# Altium project Ixora.PrjPCB (part 3 of 3)
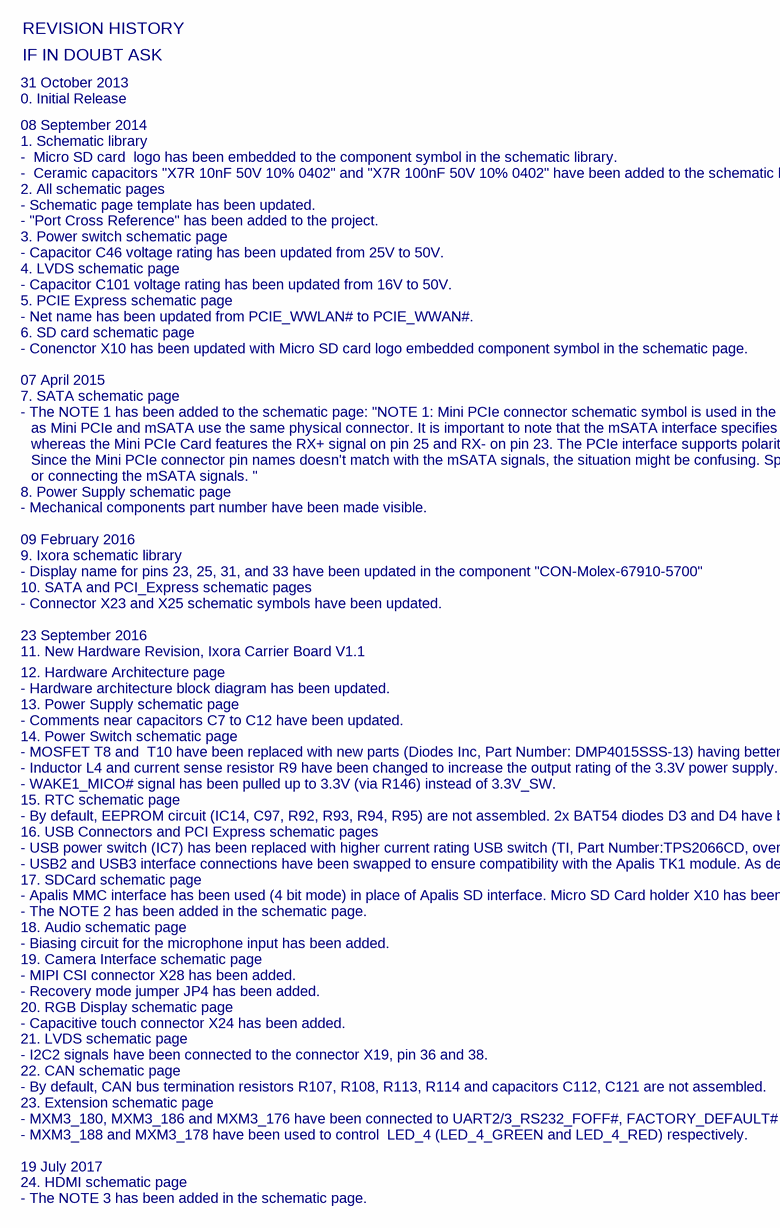
[diagram p16: Revision_History.SchDoc]

## Nets that join several sheets
3.3V: Camera_Interface (R129.1), Power_Supply (16 pins), Power_Switch (20 pins), Extension (R89.1)
3.3V_SW: Audio (IC8.3), Camera_Interface (7 pins), Ethernet (X11.14 X11.16), PCI_Express (5 pins), Power_Supply (C1.2 R1.1 X4.1), Power_Switch (6 pins), RGB_Display (6 pins), RTC (10 pins), Sata (8 pins), SDCard (8 pins), Serial (8 pins), Extension (C96.2 LED4.A LED5.A X27.29), USB_Connectors (R57.1 R59.2), USB (R48.1)
5V_SW: Audio (C86.2 IC8.1 X18.1), Camera_Interface (C133.2 X28.21), Power_Supply (C2.1 X4.3), Power_Switch (6 pins), Extension (C65.2 X27.12), USB_Connectors (IC6.2 IC7.2)
AGND: Audio (13 pins), Power_Supply (X1.303 X1.304 X1.308 X1.313), Extension (X27.26)
AVCC: Audio (C85.2 IC8.5 R148.2), Power_Supply (X1.314 X1.320)
GND: Audio (5 pins), Camera_Interface (11 pins), Ethernet (7 pins), PCI_Express (23 pins), Power_Supply (61 pins), Power_Switch (57 pins), RGB_Display (16 pins), RTC (9 pins), Sata (24 pins), SDCard (5 pins), Serial (10 pins), Extension (16 pins), USB_Connectors (22 pins), USB (5 pins)
SHIELD1: Ethernet (X11.S1 X11.S2), Power_Supply (L3.2), SDCard (R117.2 X10.S1 X10.S2), Extension (SW3.SH1 SW3.SH2), USB_Connectors (12 pins)
SHIELD2: Power_Supply (L18.2), Power_Switch (SW1.SH1 SW1.SH2 SW2.SH1 SW2.SH2)
V_SUPPLY_FILT: Power_Supply (C4.2 C5.2 C6.2 L1.2), Power_Switch (26 pins)
V_SUPPLY_FILT_SW: Power_Supply (X4.5), Power_Switch (6 pins)
VCC_INTRTC: Power_Supply (C13.2 X1.174), RTC (R39.2)
AN1_TSWIP: RGB_Display (C90.2 X16.6), Extension (R145.2)
GPIO1: Camera_Interface (R150.2), Extension (RA1.8 X27.13)
GPIO2: Camera_Interface (R151.2), Extension (RA1.7 X27.14)
GPIO3: Camera_Interface (R152.2), Extension (RA1.6 X27.15)
GPIO4: Camera_Interface (R153.2), Extension (RA1.5 X27.16)
GPIO5: RGB_Display (X24.4), Extension (RA3.8 X27.17)
GPIO6: RGB_Display (X24.5), Extension (RA3.7 X27.18)
GPIO8: Power_Switch (R35.2), Extension (RA3.5 X27.20)
I2C1_SCL: PCI_Express (R135.1), RGB_Display (X24.2), RTC (IC5.6 IC14.6 R42.1 RA13.7), Sata (R121.1), Extension (X27.6)
I2C1_SDA: PCI_Express (R136.1), RGB_Display (X24.1), RTC (IC5.5 IC14.5 R41.1 RA13.8), Sata (R122.1), Extension (X27.5)
LED_5_GREEN: SDCard (X1.152), Extension (R85.1 T14.2)
LED_5_RED: SDCard (X1.156), Extension (R88.1 T14.5)
PCIE1_WDISABLE#_R: PCI_Express (R53.2), Extension (X1.176)
POWER_ENABLE_MOCI: Power_Switch (5 pins), Extension (X27.2)
RECOVERY_MODE#: Camera_Interface (JP4.2 X1.63), Extension (R90.2)
RESET_MICO#: Power_Switch (RA6.8 SW2.2 X5.6), Extension (X27.1)
RESET_MOCI#: PCI_Express (X25.22), Power_Switch (IC4.1 RA6.7 T6.2), RGB_Display (R81.1), Extension (X27.4)
SPI2_CLK: RGB_Display (X24.7), Extension (R142.1)
SPI2_CS: RGB_Display (X24.8), Extension (R141.1)
SPI2_MISO: RGB_Display (X24.10), Extension (R130.1)
SPI2_MOSI: RGB_Display (X24.9), Extension (R131.1)
UART2/3_RS232_FOFF#: Serial (IC12.22 R116.1), Extension (X1.180)
UART3_RXD: Serial (JP3.2 RA16.6), Extension (X27.27)
UART3_TXD: Serial (IC12.12 RA16.5), Extension (X27.28)
UART4_RXD: Serial (RA16.8), Extension (X27.30)
UART4_TXD: Serial (RA16.7), Extension (X27.31)
USBH2_D_N: PCI_Express (R118.1), USB_Connectors (R50.1), USB (X1.82)
USBH2_D_P: PCI_Express (R119.1), USB_Connectors (R69.1), USB (X1.80)
USBH3_D_N: PCI_Express (R120.1), USB_Connectors (R96.1), USB (X1.88)
USBH3_D_P: PCI_Express (R126.1), USB_Connectors (R103.1), USB (X1.86)
USBH4_D_N: USB_Connectors (L13.2), USB (X1.100)
USBH4_D_P: USB_Connectors (L13.1), USB (X1.98)
USBH4_SSRX_N: USB_Connectors (D6.2 X8.U5), USB (X1.92)
USBH4_SSRX_P: USB_Connectors (D6.1 X8.U6), USB (X1.94)
USBH4_SSTX_N: USB_Connectors (D7.2 X8.U8), USB (X1.104)
USBH4_SSTX_P: USB_Connectors (D7.1 X8.U9), USB (X1.106)
USBH_EN: USB_Connectors (IC6.3 IC7.4), USB (R49.2 RA8.6)
USBH_OC#: USB_Connectors (IC6.8 IC7.5), USB (R48.2 RA8.5)
USBO1_D_N: USB_Connectors (L15.2), USB (X1.76)
USBO1_D_P: USB_Connectors (L15.1), USB (X1.74)
USBO1_EN: USB_Connectors (IC7.3), USB (R2.2 R47.2)
USBO1_ID: USB_Connectors (D12.1 JP2.1 R57.2 X9.4), USB (RA8.7)
USBO1_OC#: USB_Connectors (IC7.8 R59.1), USB (R46.2)
USBO1_SSRX_N: USB_Connectors (D9.2 X8.L5), USB (X1.64)
USBO1_SSRX_P: USB_Connectors (D9.1 X8.L6), USB (X1.62)
USBO1_SSTX_N: USB_Connectors (D10.1 X8.L8), USB (X1.70)
USBO1_SSTX_P: USB_Connectors (D10.2 X8.L9), USB (X1.68)
USBO1_VBUS: USB_Connectors (D12.2 R56.1), USB (RA8.8)
WAKE1_MICO#: PCI_Express (R137.1), Power_Switch (R146.1 RA6.5), Extension (X27.3)

## Assembly variants
Ixora v01.0.001: not fitted C27 C34 C35 C43 C46 C48 C49 C81 C84 L6 L7 LED2 MECH2 R14 R24 R25 R29 R36 R39 R68 R72 R83 R86 R90 R92 R93 R94 R95 R98 R99 R101 R102 R121 R122 R135 R136 T6 TP5 TP6 X3 X4 X18
Ixora V1.1.001: not fitted C27 C34 C35 C43 C46 C48 C49 C81 C84 C97 C112 C121 IC14 JP4 L6 L7 LED2 MECH2 R14 R24 R25 R29 R36 R39 R50 R68 R69 R72 R83 R86 R90 R92 R93 R94 R95 R98 R99 R101 R102 R107 R108 R109 R110 R113 R114 R117 R120 R121 R122 R126 R135 R136 T6 TP5 TP6 X3 X4 X18